# EAGLE design prototype-mark-II (EAGLE 7.6.0)
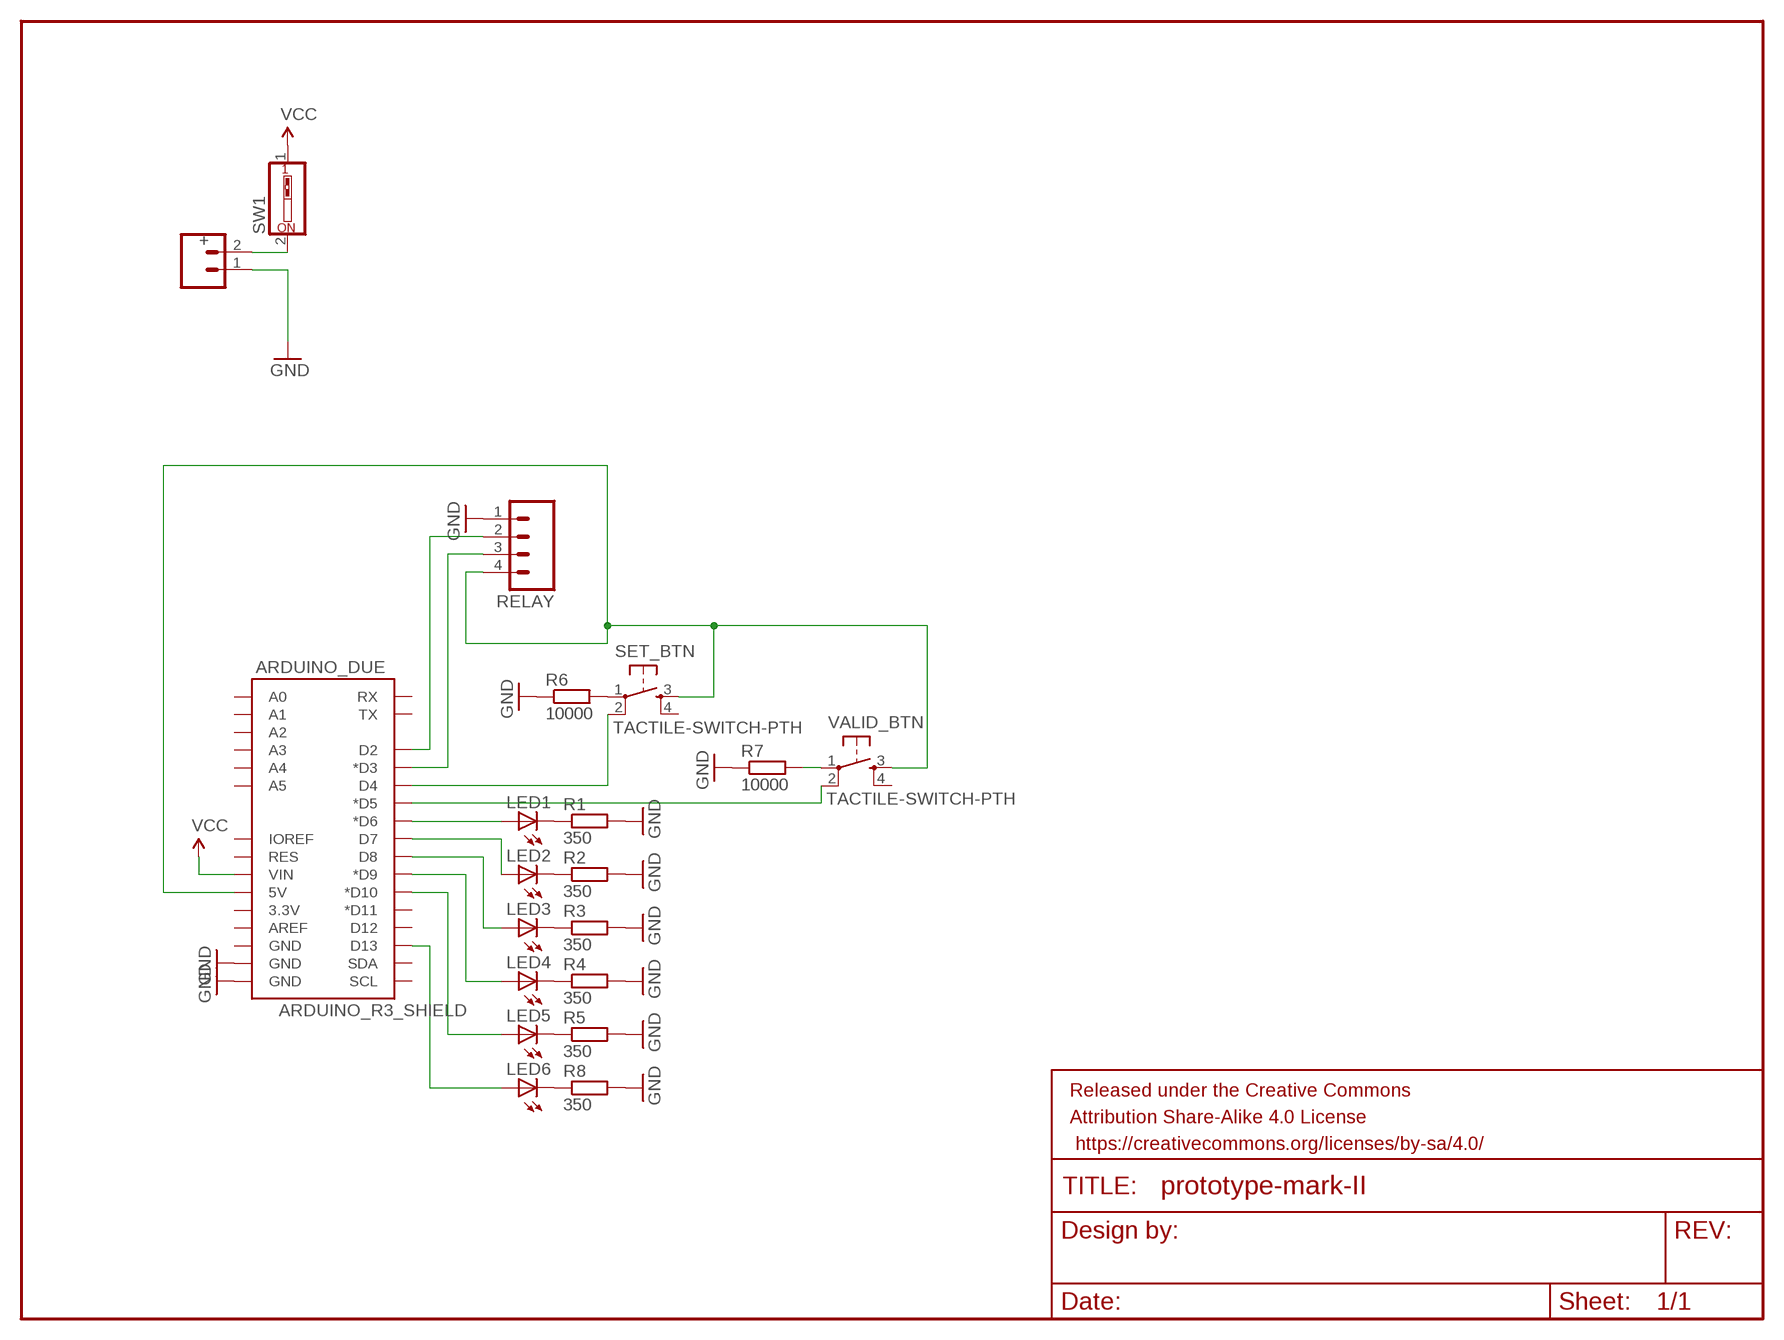
[diagram p0: schematic, sheet 1]

## Parts
+  M02PTH  [1X02]
ARDUINO_DUE  ARDUINO_R3_SHIELD  [UNO_R3_SHIELD]
FRAME1  FRAME-LETTERNO_PACKAGE  [DUMMY]
LED1  LED3MM  [LED3MM]
LED2  LED3MM  [LED3MM]
LED3  LED3MM  [LED3MM]
LED4  LED3MM  [LED3MM]
LED5  LED3MM  [LED3MM]
LED6  LED3MM  [LED3MM]
R1  350  R0204/7  [0204/7]
R2  350  R0204/7  [0204/7]
R3  350  R0204/7  [0204/7]
R4  350  R0204/7  [0204/7]
R5  350  R0204/7  [0204/7]
R6  10000  R0204/7  [0204/7]
R7  10000  R0204/7  [0204/7]
R8  350  R0204/7  [0204/7]
RELAY  M04PTH  [1X04]
SET_BTN  TACTILE-SWITCH-PTH  [TAC-SWITCH-PTH]
SW1  SW_DIP-1  [EDG-01]
VALID_BTN  TACTILE-SWITCH-PTH  [TAC-SWITCH-PTH]

## Nets
GND: +.1 ARDUINO_DUE.GND@0(GND) ARDUINO_DUE.GND@1(GND) R1.2 R2.2 R3.2 R4.2 R5.2 R6.1 R7.1 R8.2 RELAY.1
N$1: ARDUINO_DUE.D6(*D6) LED1.A
N$2: LED1.K(C) R1.1
N$3: ARDUINO_DUE.D7 LED2.A
N$4: LED2.K(C) R2.1
N$5: ARDUINO_DUE.D8 LED3.A
N$6: ARDUINO_DUE.D9(*D9) LED4.A
N$7: ARDUINO_DUE.D10(*D10) LED5.A
N$8: LED3.K(C) R3.1
N$9: LED4.K(C) R4.1
N$10: LED5.K(C) R5.1
N$11: R6.2 SET_BTN.1
N$12: ARDUINO_DUE.D5(*D5) VALID_BTN.2
N$13: ARDUINO_DUE.5V RELAY.4 SET_BTN.3 VALID_BTN.3
N$14: R7.2 VALID_BTN.1
N$15: ARDUINO_DUE.D4 SET_BTN.2
N$16: +.2 SW1.2
N$17: LED6.K(C) R8.1
N$18: ARDUINO_DUE.D13 LED6.A
N$19: ARDUINO_DUE.D3(*D3) RELAY.3
N$20: ARDUINO_DUE.D2 RELAY.2
VCC: ARDUINO_DUE.VIN SW1.1
Unconnected: ARDUINO_DUE.3.3V ARDUINO_DUE.A0 ARDUINO_DUE.A1 ARDUINO_DUE.A2 ARDUINO_DUE.A3 ARDUINO_DUE.A4 ARDUINO_DUE.A5 ARDUINO_DUE.AREF ARDUINO_DUE.D11(*D11) ARDUINO_DUE.D12 ARDUINO_DUE.GND@2(GND) ARDUINO_DUE.IOREF ARDUINO_DUE.RES ARDUINO_DUE.RX ARDUINO_DUE.SCL ARDUINO_DUE.SDA ARDUINO_DUE.TX SET_BTN.4 VALID_BTN.4

## Library data of the parts
+ = SparkFun-Connectors:M02: Standard 2-pin 0.1" header. Use with - straight break away headers ( PRT-00116) - right angle break away headers (PRT-00553) - swiss pins (PRT-00743) - machine pins (PRT-00117) - female headers (PRT-00115) Molex polarized connector foot print use with: PRT-08233 with associated crimp pins and housings. 2.54_SCREWTERM for use with PRT-10571. 3.5mm Screw Terminal footprints for PRT-08084 5mm Screw Terminal footprints for use with PRT-08432
ARDUINO_DUE = SparkFun-Boards:ARDUINO_R3_SHIELD: Shield form compatible with the Arduino Uno R3.
FRAME1 = SparkFun-Aesthetics:FRAME-LETTER: Schematic Frame Standard 8.5x11 US Letter frame; DESIGNER: Nobody; VERSION: v01
LED1-LED6 = led:LED: LED OSRAM: - CHIPLED LG R971, LG N971, LY N971, LG Q971, LY Q971, LO R971, LY R971 LH N974, LH R974 LS Q976, LO Q976, LY Q976 LO Q996 - Hyper CHIPLED LW Q18S LB Q993, LB Q99A, LB R99A - SideLED LS A670, LO A670, LY A670, LG A670, LP A670 LB A673, LV A673, LT A673, LW A673 LH A674 LY A675 LS A676, LA A676, LO A676, LY A676, LW A676 LS A679, LY A679, LG A679 - Hyper Micro SIDELED® LS Y876, LA Y876, LO Y876, LY Y876 LT Y87S - SmartLED LW L88C, LW L88S LB L89C, LB L89S, LG L890 LS L89K, LO L89K, LY L89K LS L896, LA L896, LO L896, LY L896 - TOPLED LS T670, LO T670, LY T670, LG T670, LP T670 LSG T670, LSP T670, LSY T670, LOP T670, LYG T670 LG T671, LOG T671, LSG T671 LB T673, LV T673, LT T673, LW T673 LH T674 LS T676, LA T676, LO T676, LY T676, LB T676, LH T676, LSB T676, LW T676 LB T67C, LV T67C, LT T67C, LS T67K, LO T67K, LY T67K, LW E67C LS E67B, LA E67B, LO E67B, LY E67B, LB E67C, LV E67C, LT E67C LW T67C LS T679, LY T679, LG T679 LS T770, LO T770, LY T770, LG T770, LP T770 LB T773, LV T773, LT T773, LW T773 LH T774 LS E675, LA E675, LY E675, LS T675 LS T776, LA T776, LO T776, LY T776, LB T776 LHGB T686 LT T68C, LB T68C - Hyper Mini TOPLED® LB M676 - Mini TOPLED Santana® LG M470 LS M47K, LO M47K, LY M47K Source: http://www.osram.convergy.de LUXEON: - LUMILED® LXK2-PW12-R00, LXK2-PW12-S00, LXK2-PW14-U00, LXK2-PW14-V00 LXK2-PM12-R00, LXK2-PM12-S00, LXK2-PM14-U00 LXK2-PE12-Q00, LXK2-PE12-R00, LXK2-PE12-S00, LXK2-PE14-T00, LXK2-PE14-U00 LXK2-PB12-K00, LXK2-PB12-L00, LXK2-PB12-M00, LXK2-PB14-N00, LXK2-PB14-P00, LXK2-PB14-Q00 LXK2-PR12-L00, LXK2-PR12-M00, LXK2-PR14-Q00, LXK2-PR14-R00 LXK2-PD12-Q00, LXK2-PD12-R00, LXK2-PD12-S00 LXK2-PH12-R00, LXK2-PH12-S00 LXK2-PL12-P00, LXK2-PL12-Q00, LXK2-PL12-R00 Source: www.luxeon.com KINGBRIGHT: KA-3528ASYC Source: www.kingbright.com
R1-R8 = eagle-ltspice:R: RESISTOR, European symbol; SPICEMODEL: NONE; SPICEPREFIX: R
RELAY = SparkFun-Connectors:M04: Header 4 Standard 4-pin 0.1" header. Use with straight break away headers (SKU : PRT-00116), right angle break away headers (PRT-00553), swiss pins (PRT-00743), machine pins (PRT-00117), and female headers (PRT-00115). Molex polarized connector foot print use with SKU : PRT-08231 with associated crimp pins and housings. 1MM SMD Version SKU: PRT-10208; PROD_ID: CONN-09696
SET_BTN VALID_BTN = GeekAmmo:TACTILE-SWITCH: Tactile Switch 4 Pins, SPST NO
SW1 = special:SW_DIP-1: DIP SWITCH

## Board
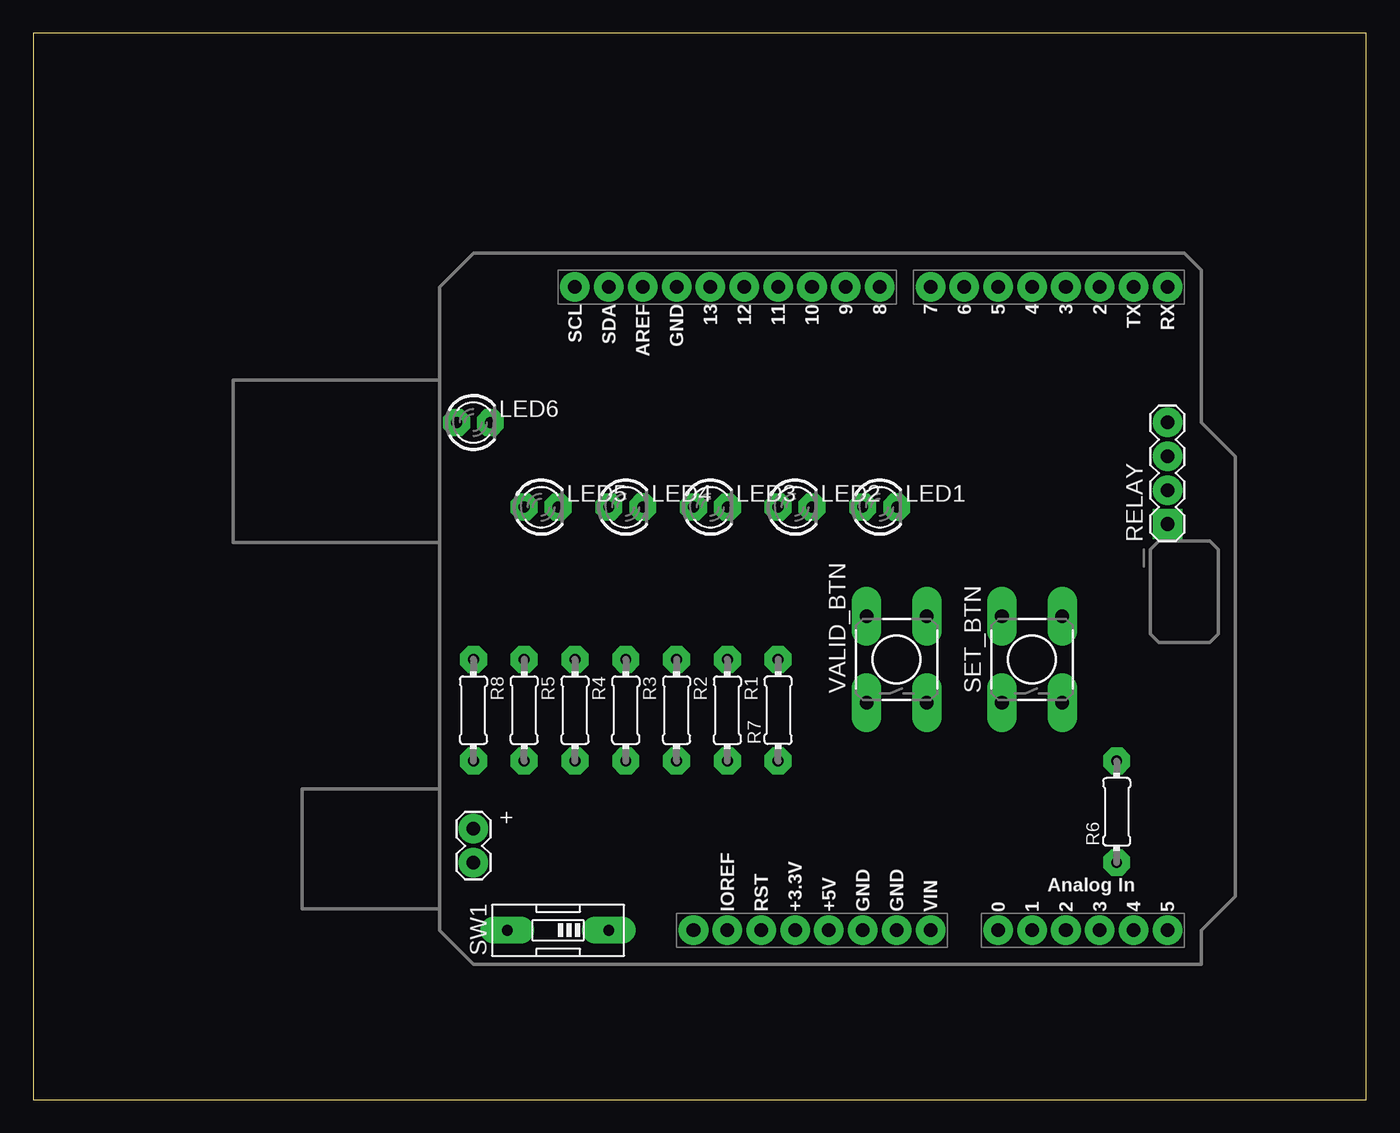
[diagram p1: board, top side]
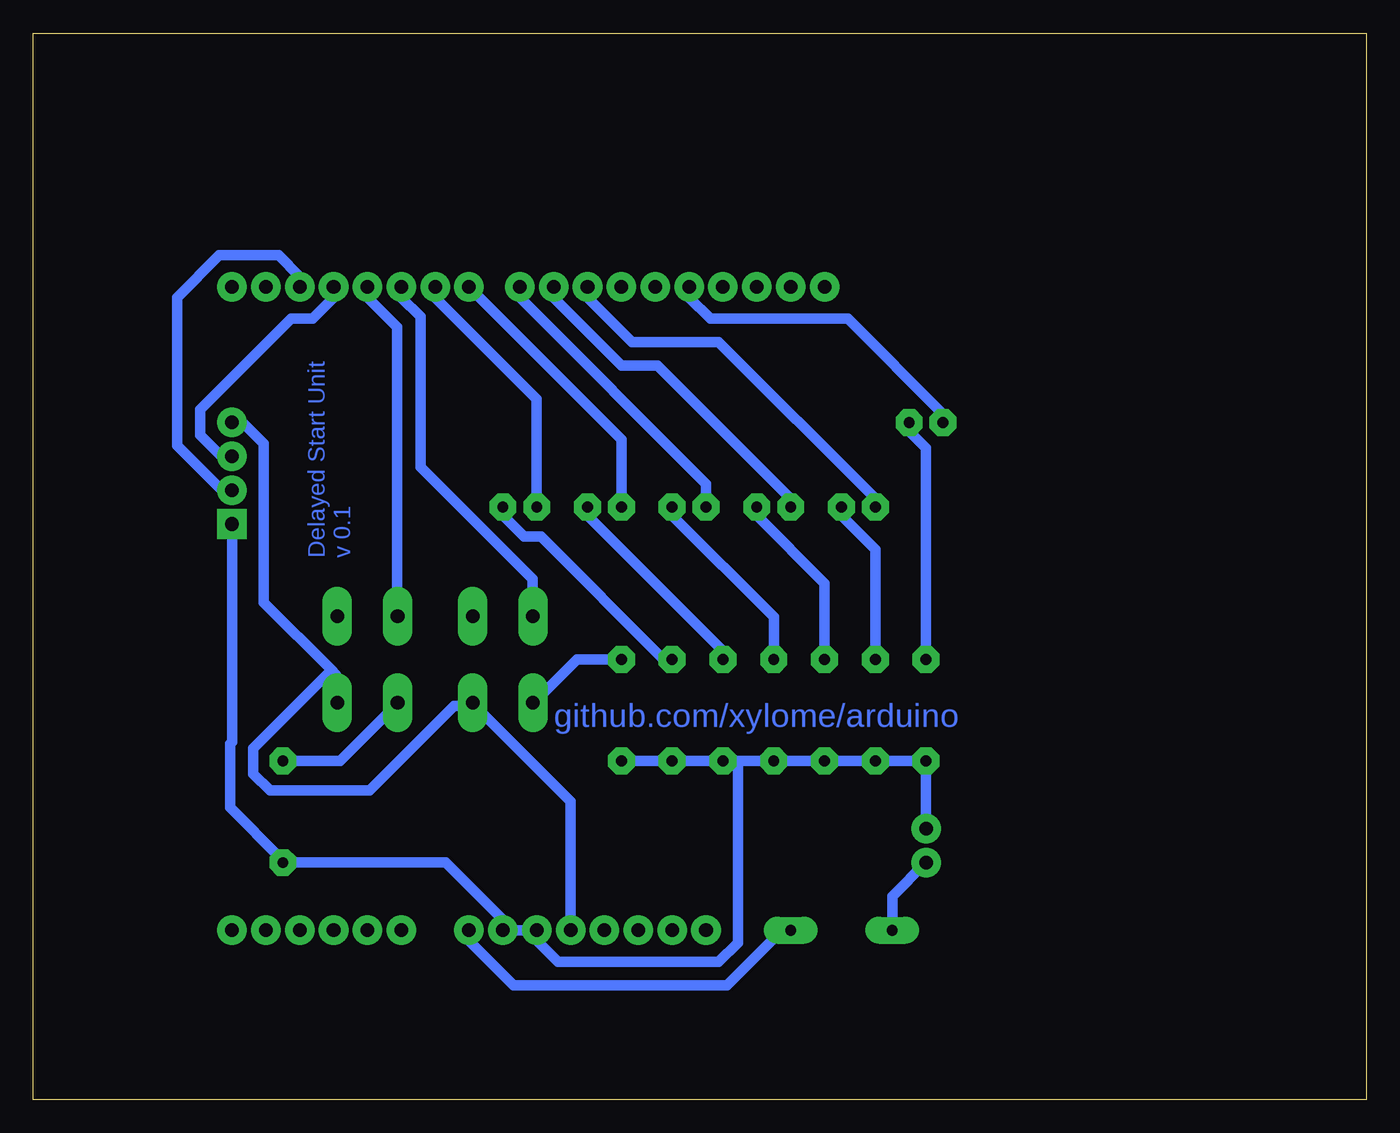
[diagram p2: board, bottom side, seen from below]

Size 100 x 80 mm. Coordinates in mm from the lower left corner, seen from the top.
Outline: 0,0 100,0 100,80 0,80 0,0
Copper layers (1*16): Top 0.035mm / dielectric 1.5mm / Bottom 0.035mm
Design rules "arno-rules": minimum track width 0.8mm, minimum drill 0.8mm, track to track 0.8mm, track to pad 0.8mm, pad to pad 0.45mm, via to via 0.8mm, smd to smd 8mil, copper to edge 10mil, drill to drill 8mil, minimum pad ring 0.6mm, minimum via ring 0.6mm, stop-mask expansion 0mil, vias tented up to drill 0mil, thermal gap 10mil

### Footprints (pad centres in the part's own frame; a part is rotated, then mirrored left to right if it is on the bottom)
1X02 = drill 1.016 pad 1.88: 1 0,0; 2 2.54,0
UNO_R3_SHIELD = drill 1.016 pad 1.88: 3.3V 50.8,26.67; 5V 50.8,29.21; A0 50.8,41.91; A1 50.8,44.45; A2 50.8,46.99; A3 50.8,49.53; A4 50.8,52.07; A5 50.8,54.61; AREF 2.54,15.24; D2 2.54,49.53; D3 2.54,46.99; D4 2.54,44.45; D5 2.54,41.91; D6 2.54,39.37; D7 2.54,36.83; D8 2.54,33.02; D9 2.54,30.48; D10 2.54,27.94; D11 2.54,25.4; D12 2.54,22.86; D13 2.54,20.32; GND@0 50.8,31.75; GND@1 50.8,34.29; GND@2 2.54,17.78; IOREF 50.8,21.59; NC 50.8,19.05; RES 50.8,24.13; RX 2.54,54.61; SCL 2.54,10.16; SDA 2.54,12.7; TX 2.54,52.07; VIN 50.8,36.83
LED3MM = drill 0.813 octagon: A -1.27,0; K 1.27,0
0204/7 = drill 0.813 octagon: 1 -3.81,0; 2 3.81,0
1X04 = drill 1.016 pad 1.88 square: 1 0,0 | drill 1.016 pad 1.88: 2 2.54,0; 3 5.08,0; 4 7.62,0
TAC-SWITCH-PTH = drill 1.016 pad 1.524 long: 1 -3.251,2.261; 2 3.251,2.261; 3 -3.251,-2.261; 4 3.251,-2.261
EDG-01 = drill 0.813 long: 1 0,-3.81; 2 0,3.81

### Placement (x,y rotation side)
+  33.02,20.32 270 top
ARDUINO_DUE  30.48,63.5 270 top
FRAME1  -82.55,0 0 top  (outside the outline)
LED1  63.5,44.45 0 top
LED2  57.15,44.45 0 top
LED3  50.8,44.45 0 top
LED4  44.45,44.45 0 top
LED5  38.1,44.45 0 top
LED6  33.02,50.8 0 top
R1  52.07,29.21 270 top
R2  48.26,29.21 270 top
R3  44.45,29.21 270 top
R4  40.64,29.21 270 top
R5  36.83,29.21 270 top
R6  81.28,21.59 90 top
R7  55.88,29.21 90 top
R8  33.02,29.21 270 top
RELAY  85.09,43.18 90 top
SET_BTN  74.93,33.02 90 top
SW1  39.37,12.7 90 top
VALID_BTN  64.77,33.02 90 top

### Tracks (layer width: path | path; a pad name or v marks a point on that pad's centre or on a via)
GND
  Bottom 0.8: 47.15,25.4 R3.2 R4.2 R5.2 R8.2 +.1 | 47.15,25.4 R2.2 R1.2 R7.1 | RELAY.1 85.09,26.83 85.25,26.67 85.25,21.91 81.44,18.1 R6.1 69.06,17.78 64.77,13.49 ARDUINO_DUE.GND@1 ARDUINO_DUE.GND@0 62.71,12.38 60.64,10.32 48.58,10.32 47.15,11.75 47.15,25.4
N$1
  Bottom 0.8: LED1.A 62.23,52.55 69.85,60.17 ARDUINO_DUE.D6
N$2
  Bottom 0.8: R1.1 52.7,33.02 61.91,42.23 63.18,42.23 64.77,43.81 LED1.K
N$3
  Bottom 0.8: LED2.A 55.88,49.53 ARDUINO_DUE.D7
N$4
  Bottom 0.8: R2.1 48.26,33.66 58.42,43.81 LED2.K
N$5
  Bottom 0.8: LED3.A 49.53,46.2 63.5,60.17 ARDUINO_DUE.D8
N$6
  Bottom 0.8: LED4.A 43.18,45.09 53.18,55.09 55.88,55.09 60.96,60.17 ARDUINO_DUE.D9
N$7
  Bottom 0.8: LED5.A 36.83,45.09 48.58,56.83 55.09,56.83 58.42,60.17 ARDUINO_DUE.D10
N$8
  Bottom 0.8: R3.1 44.45,36.2 52.07,43.81 LED3.K
N$9
  Bottom 0.8: R4.1 40.64,38.73 45.72,43.81 LED4.K
N$10
  Bottom 0.8: R5.1 36.83,41.27 39.37,43.81 LED5.K
N$11
  Bottom 0.8: R6.2 76.99,25.4 72.71,29.69 SET_BTN.1
N$12
  Bottom 0.8: ARDUINO_DUE.D5 72.39,60.17 70.96,58.74 70.96,47.47 62.55,39.05 62.55,36.35 VALID_BTN.2
N$13
  Bottom 0.8: ARDUINO_DUE.5V 59.69,22.38 66.99,29.69 VALID_BTN.3 67.31,29.53 68.42,29.53 74.77,23.18 82.23,23.18 83.5,24.45 83.5,26.35 77.63,32.23 | 77.63,32.23 82.71,37.31 82.71,49.21 84.3,50.8 RELAY.4 | 77.63,32.23 77.31,31.91 77.31,29.84 SET_BTN.3
N$14
  Bottom 0.8: R7.2 59.21,33.02 62.39,29.84 VALID_BTN.1
N$15
  Bottom 0.8: ARDUINO_DUE.D4 74.93,60.17 72.71,57.94 72.71,36.35 SET_BTN.2
N$16
  Bottom 0.8: SW1.2 35.56,15.24 +.2
N$17
  Bottom 0.8: R8.1 33.02,48.9 34.29,50.16 LED6.K
N$18
  Bottom 0.8: LED6.A 31.75,51.44 38.89,58.58 49.21,58.58 50.8,60.17 ARDUINO_DUE.D13
N$19
  Bottom 0.8: RELAY.3 85.88,48.26 87.47,49.85 87.47,51.75 80.64,58.58 79.06,58.58 77.47,60.17 ARDUINO_DUE.D3
N$20
  Bottom 0.8: RELAY.2 85.88,45.72 89.22,49.05 89.22,60.17 86.04,63.34 81.6,63.34 80.01,61.75 ARDUINO_DUE.D2
VCC
  Bottom 0.8: SW1.1 43.81,12.7 47.94,8.57 63.98,8.57 67.31,11.91 ARDUINO_DUE.VIN

### Text on the board
Bottom: Delayed Start Unit / v 0.1 | github.com/xylome/arduino